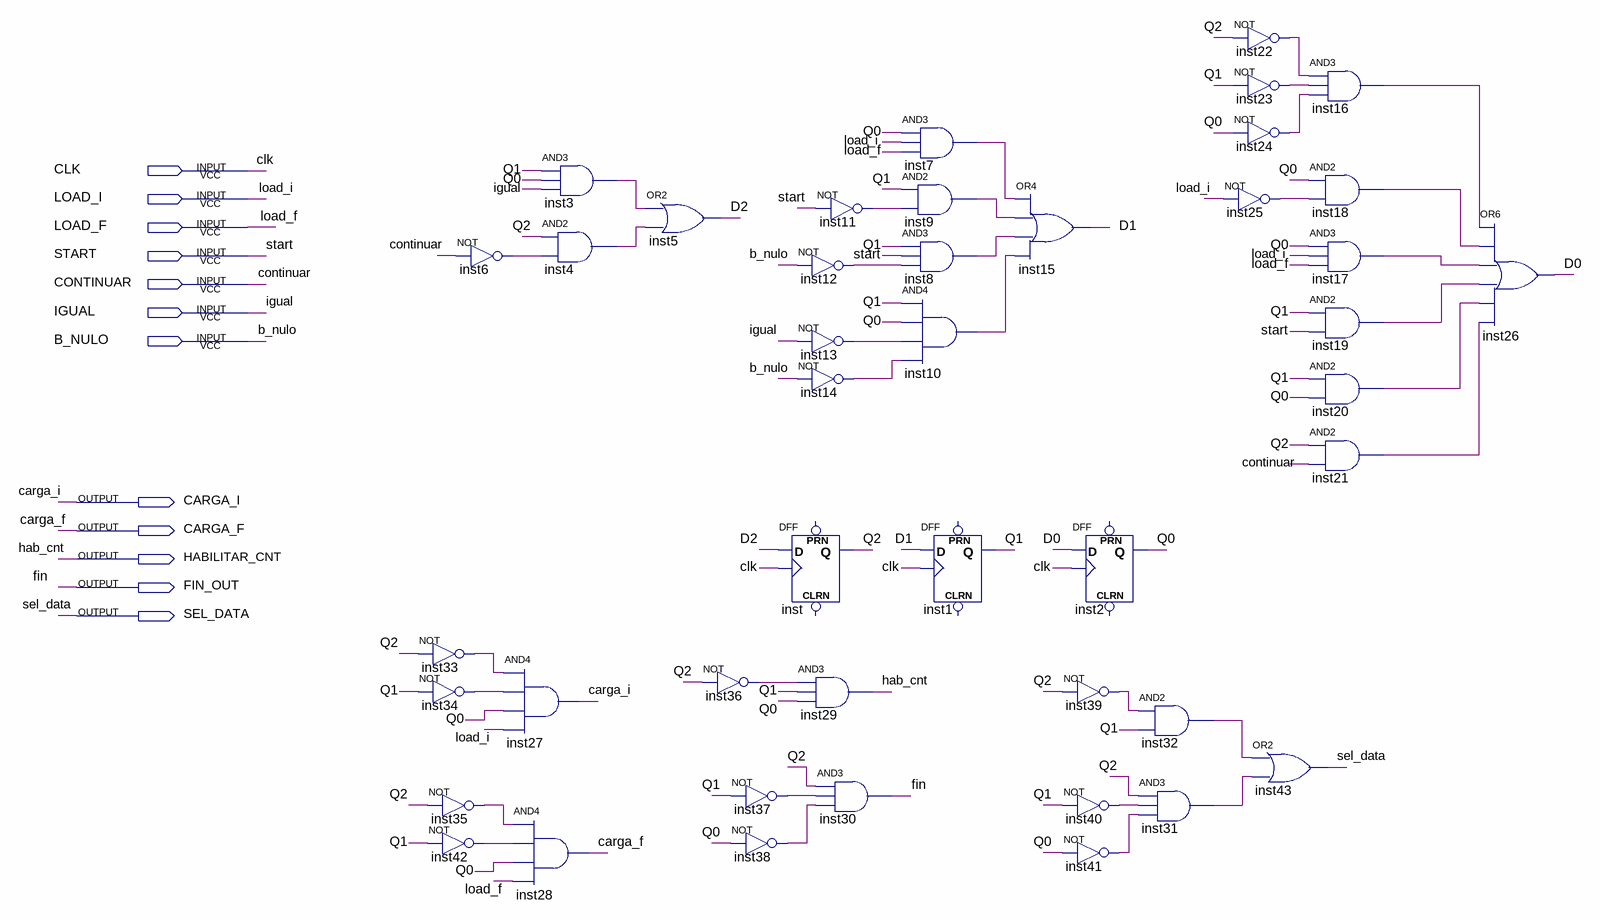
[diagram p0: schematic sheet]
// Quartus schematic maquina_estados.bdf as structural Verilog: 44 symbols, 12 pins
module maquina_estados (
  input  CLK,
  input  LOAD_I,
  input  LOAD_F,
  input  START,
  input  CONTINUAR,
  input  IGUAL,
  input  B_NULO,
  output CARGA_I,
  output CARGA_F,
  output HABILITAR_CNT,
  output FIN_OUT,
  output SEL_DATA
);

  wire D0, D1, D2, inst3_out, inst4_out, inst6_out, inst7_out, inst8_out, inst9_out, inst10_out, inst11_out,
       inst12_out, inst13_out, inst14_out, inst16_out, inst17_out, inst18_out, inst19_out, inst20_out,
       inst21_out, inst22_out, inst23_out, inst24_out, inst25_out, inst31_out, inst32_out, inst33_out,
       inst34_out, inst35_out, inst36_out, inst37_out, inst38_out, inst39_out, inst40_out, inst41_out,
       inst42_out, Q0, Q1, Q2;

  not inst33 (inst33_out, Q2);
  not inst34 (inst34_out, Q1);
  not inst35 (inst35_out, Q2);
  not inst42 (inst42_out, Q1);
  not inst6 (inst6_out, CONTINUAR);
  and inst27 (CARGA_I, inst33_out, inst34_out, Q0, LOAD_I);
  and inst28 (CARGA_F, inst35_out, inst42_out, Q0, LOAD_F);
  and inst3 (inst3_out, Q1, Q0, IGUAL);
  and inst4 (inst4_out, Q2, inst6_out);
  or inst5 (D2, inst3_out, inst4_out);
  not inst36 (inst36_out, Q2);
  not inst37 (inst37_out, Q1);
  not inst38 (inst38_out, Q0);
  not inst11 (inst11_out, START);
  not inst12 (inst12_out, B_NULO);
  not inst13 (inst13_out, IGUAL);
  not inst14 (inst14_out, B_NULO);
  DFF inst (.CLK(CLK), .D(D2), .Q(Q2));  // open: CLRN, PRN
  and inst29 (HABILITAR_CNT, inst36_out, Q1, Q0);
  and inst30 (FIN_OUT, Q2, inst37_out, inst38_out);
  and inst7 (inst7_out, Q0, LOAD_I, LOAD_F);
  and inst9 (inst9_out, Q1, inst11_out);
  and inst8 (inst8_out, Q1, START, inst12_out);
  and inst10 (inst10_out, Q1, Q0, inst13_out, inst14_out);
  DFF inst1 (.CLK(CLK), .D(D1), .Q(Q1));  // open: CLRN, PRN
  or inst15 (D1, inst7_out, inst9_out, inst8_out, inst10_out);
  DFF inst2 (.CLK(CLK), .D(D0), .Q(Q0));  // open: CLRN, PRN
  not inst39 (inst39_out, Q2);
  not inst40 (inst40_out, Q1);
  not inst41 (inst41_out, Q0);
  and inst32 (inst32_out, inst39_out, Q1);
  and inst31 (inst31_out, Q2, inst40_out, inst41_out);
  not inst22 (inst22_out, Q2);
  not inst23 (inst23_out, Q1);
  not inst24 (inst24_out, Q0);
  not inst25 (inst25_out, LOAD_I);
  or inst43 (SEL_DATA, inst32_out, inst31_out);
  and inst16 (inst16_out, inst22_out, inst23_out, inst24_out);
  and inst18 (inst18_out, Q0, inst25_out);
  and inst17 (inst17_out, Q0, LOAD_I, LOAD_F);
  and inst19 (inst19_out, Q1, START);
  and inst20 (inst20_out, Q1, Q0);
  and inst21 (inst21_out, Q2, CONTINUAR);
  or inst26 (D0, inst16_out, inst18_out, inst17_out, inst19_out, inst20_out, inst21_out);

  // Other names for the same wires on the sheet: fin = FIN_OUT; hab_cnt = HABILITAR_CNT
endmodule
